# EasyEDA schematic DelayPCB.json
TITLE: Sheet_1; REV: 1.0; Date: 2022-11-04; Sheet: 1/1; Drawn By: dezire; Company: Your Company
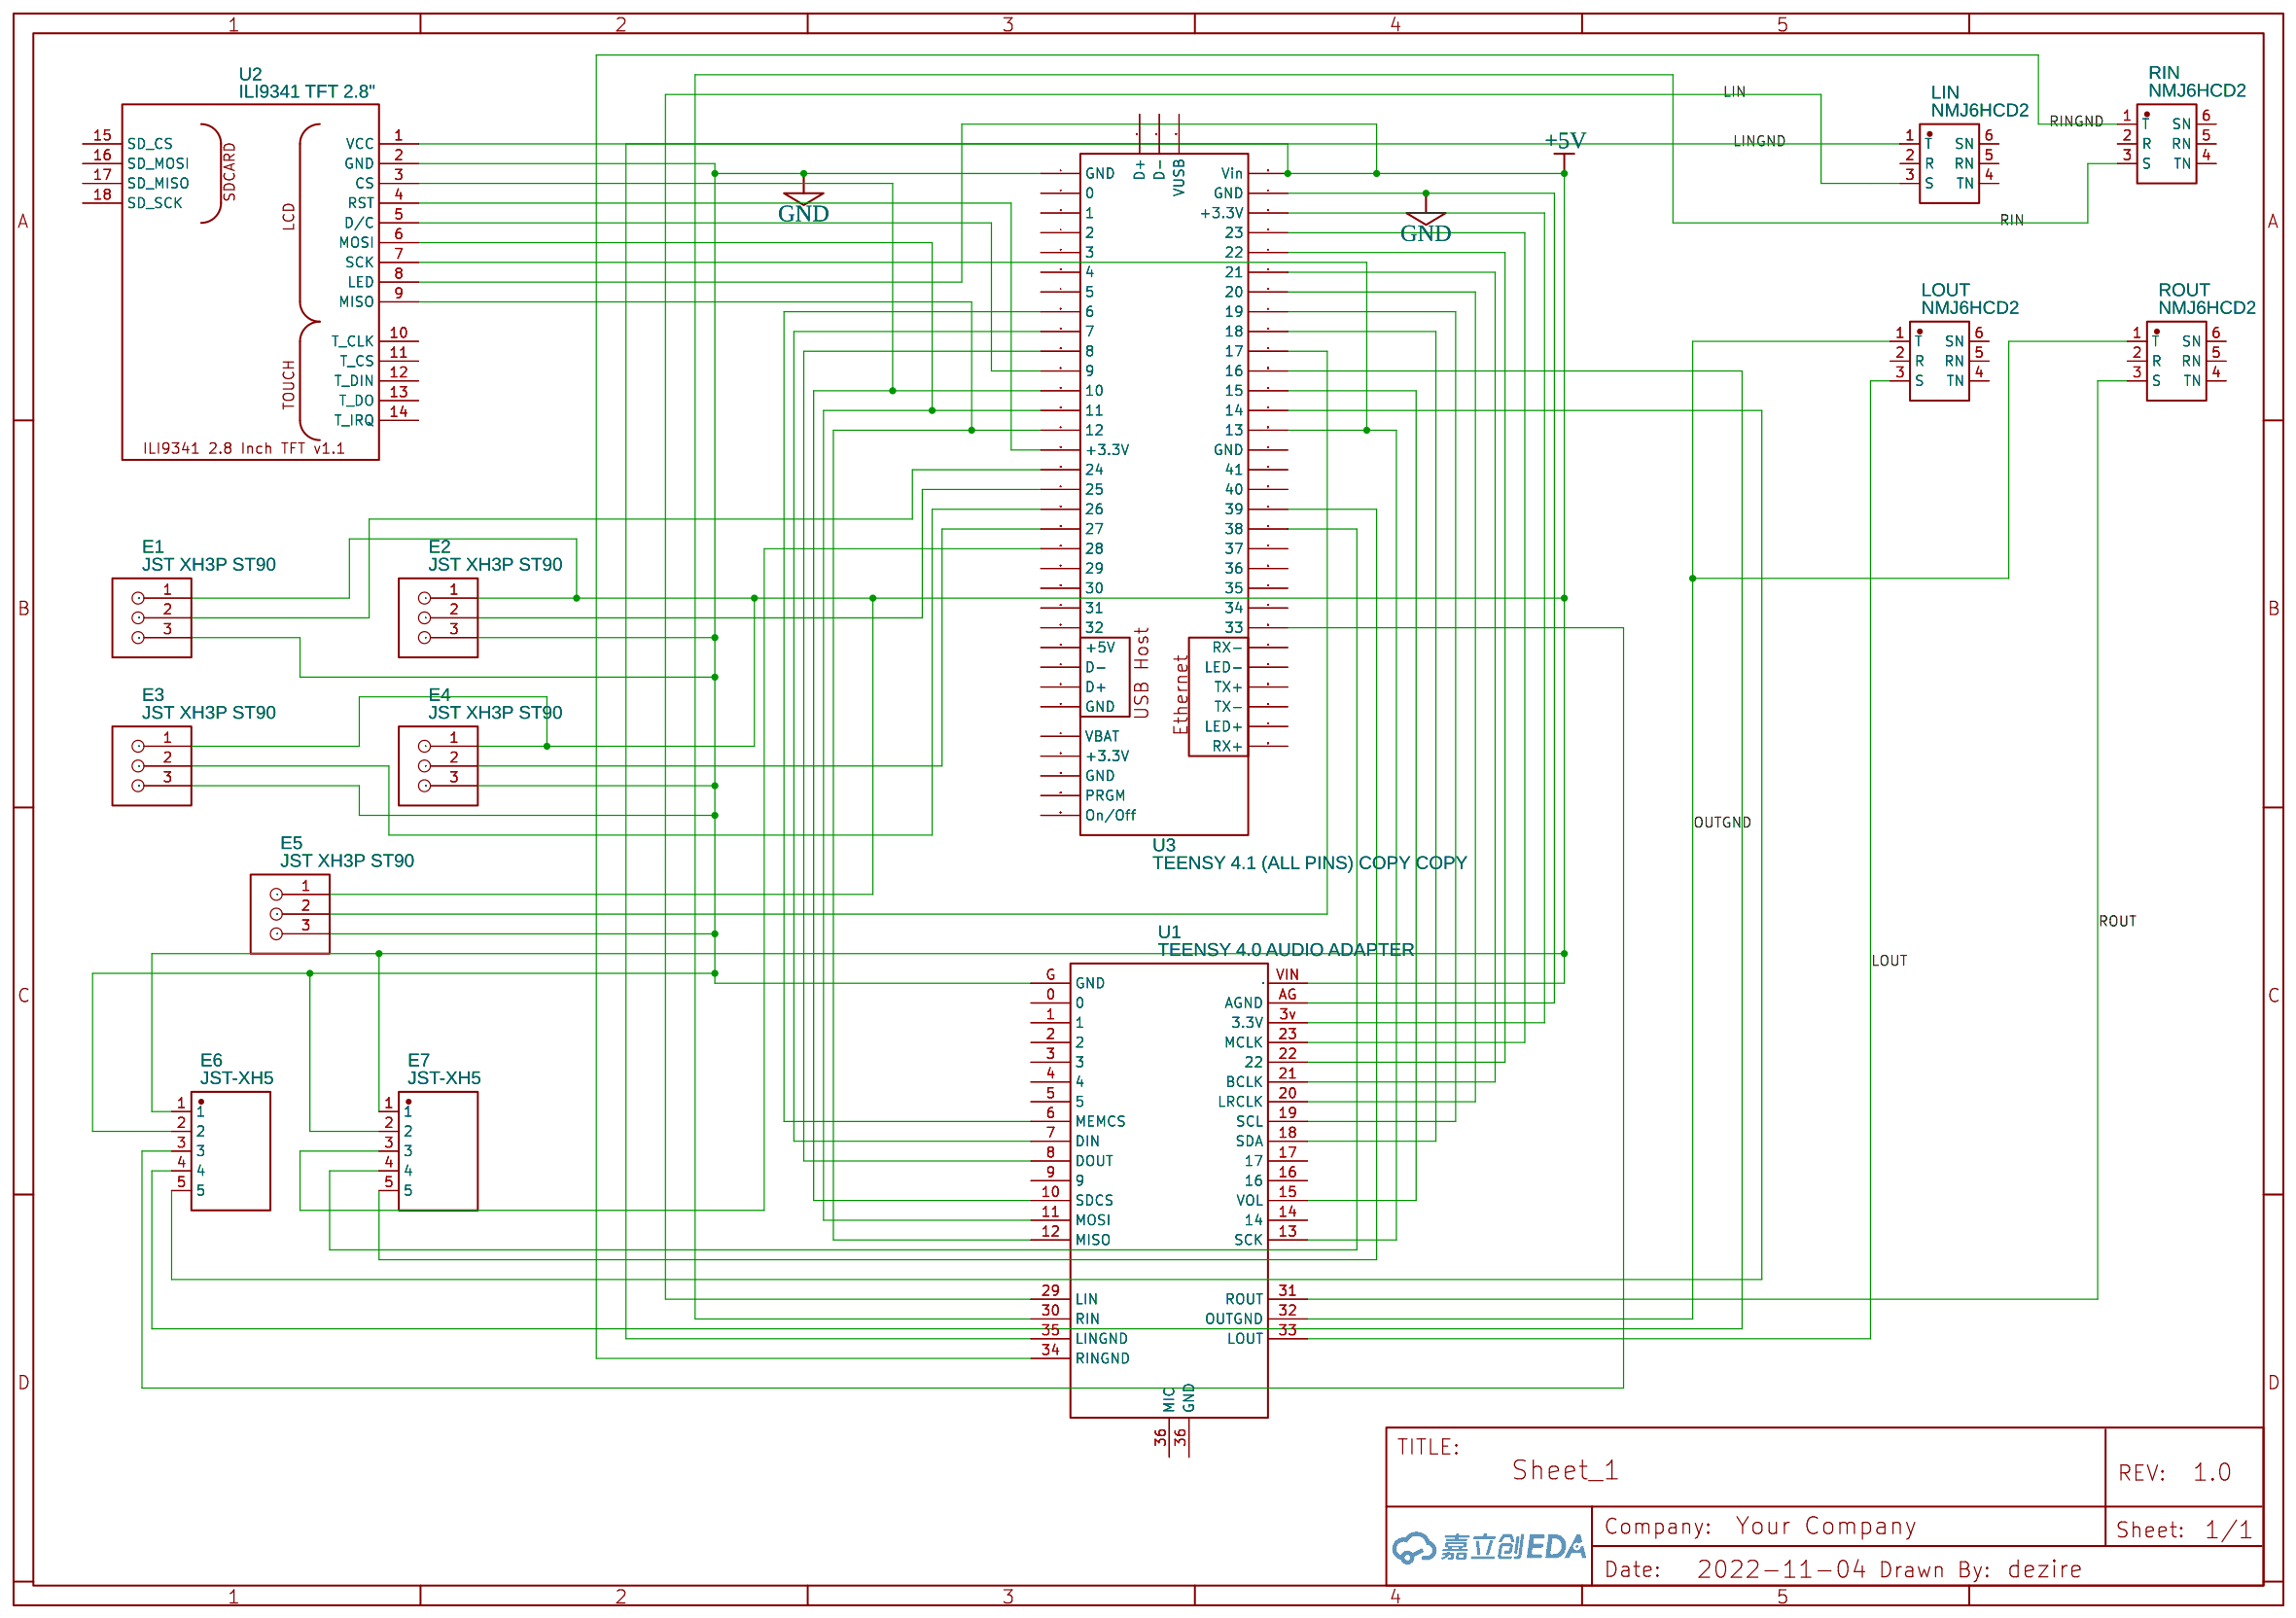
[diagram p0: schematic sheet]

## Parts
E1  JST XH3P ST90  [JST XH3P ST90]
E2  JST XH3P ST90  [JST XH3P ST90]
E3  JST XH3P ST90  [JST XH3P ST90]
E4  JST XH3P ST90  [JST XH3P ST90]
E5  JST XH3P ST90  [JST XH3P ST90]
E6  JST-XH5  [JST-XH5P]
E7  JST-XH5  [JST-XH5P]
LIN  NMJ6HCD2  [AUDIO-TH_NMJ6HCD2]
LOUT  NMJ6HCD2  [AUDIO-TH_NMJ6HCD2]
RIN  NMJ6HCD2  [AUDIO-TH_NMJ6HCD2]
ROUT  NMJ6HCD2  [AUDIO-TH_NMJ6HCD2]
U1  TEENSY 4.0 AUDIO ADAPTER  [TEENSY 4.0 AUDIO]
U2  ILI9341 TFT 2.8"  [ILI9341-2.8]
U3  TEENSY 4.1 (ALL PINS) COPY COPY  [TEENSY-4.1-ALL-PINS]

## Library data of the parts
E1-E5 = JST XH3P ST90: Manufacturer: JST; Supplier: Reichelt; Contributor: Benni620
E6 E7 = JST-XH5: Supplier: Reichelt; Supplier Part: JST XH5P ST; Manufacturer: JST; Contributor: P-Thomsen; JLCPCB Part Class: Extended Part; link: https://www.reichelt.de/jst-stiftleiste-gerade-1x5-polig-xh-jst-xh5p-st-p185076.html?&trstct=pos_2&nbc=1
LIN LOUT RIN ROUT = NMJ6HCD2: Supplier: LCSC; Supplier Part: C368502; Manufacturer: NEUTRIK(优曲克); Contributor: LCSC
U1 = TEENSY 4.0 AUDIO ADAPTER: Manufacturer Part: New SchematicLib; Contributor: Hugo Swift
U2 = ILI9341 TFT 2.8"
U3 = TEENSY 4.1 (ALL PINS) COPY COPY: Contributor: purpleprawn

## Nets
+5V: E1.1 E2.1 E3.1 E4.1 E5.1 E6.1 E7.1 U1.VIN(28) U2.1(VCC) U2.8(LED) U3.48(+3.3V)
GND: E1.3 E2.3 E3.3 E4.3 E5.3 E6.2 E7.2 U1.AG(AGND) U1.G(GND) U2.2(GND) U3.1(GND) U3.47(VBAT)
LIN: LIN.3(S) U1.29(LIN)
LINGND: LIN.1(T) U1.35(LINGND)
LOUT: LOUT.3(S) U1.33(LOUT)
OUTGND: LOUT.1(T) ROUT.1(T) U1.32(OUTGND)
RIN: RIN.3(S) U1.30(RIN)
RINGND: RIN.1(T) U1.34(RINGND)
ROUT: ROUT.3(S) U1.31(ROUT)
Net-(E1-2): E1.2 U3.16(24)
Net-(E2-2): E2.2 U3.17(25)
Net-(E3-2): E3.2 U3.18(26)
Net-(E4-2): E4.2 U3.19(27)
Net-(E5-2): E5.2 U3.39(17)
Net-(E6-3): E6.3 U3.25(33)
Net-(E6-4): E6.4 U3.38(16)
Net-(E6-5): E6.5 U3.36(14)
Net-(E7-3): E7.3 U3.20(28)
Net-(E7-4): E7.4 U3.30(38)
Net-(E7-5): E7.5 U3.31(39)
Net-(U1-3v): U1.3v(3.3V) U3.46(+3.3V)
Net-(U1-6): U1.6(MEMCS) U3.8(6)
Net-(U1-7): U1.7(DIN) U3.9(7)
Net-(U1-8): U1.8(DOUT) U3.10(8)
Net-(U1-10): U1.10(SDCS) U2.3(CS) U3.12(10)
Net-(U1-11): U1.11(MOSI) U2.6(MOSI) U3.13(11)
Net-(U1-12): U1.12(MISO) U2.9(MISO) U3.14(12)
Net-(U1-13): U1.13(SCK) U2.7(SCK) U3.35(13)
Net-(U1-15): U1.15(VOL) U3.37(15)
Net-(U1-18): U1.18(SDA) U3.40(18)
Net-(U1-19): U1.19(SCL) U3.41(19)
Net-(U1-20): U1.20(LRCLK) U3.42(GND)
Net-(U1-21): U1.21(BCLK) U3.43(D+)
Net-(U1-22): U1.22 U3.44(D-)
Net-(U1-23): U1.23(MCLK) U3.45(+5V)
Net-(U2-4): U2.4(RST) U3.15(+3.3V)
Net-(U2-5): U2.5(D/C) U3.11(9)

Not connected (* = marked no-connect by the designer): LIN 2(R) 4(TN) 5(RN) 6(SN); LOUT 2(R) 4(TN) 5(RN) 6(SN); RIN 2(R) 4(TN) 5(RN) 6(SN); ROUT 2(R) 4(TN) 5(RN) 6(SN); U1 0 1 2 3 4 5 9 14 16 17 36(GND); U2 10(T_CLK) 11(T_CS) 12(T_DIN) 13(T_DO) 14(T_IRQ) 15(SD_CS) 16(SD_MOSI) 17(SD_MISO) 18(SD_SCK); U3 2(0) 3(1) 4(2) 5(3) 6(4) 7(5) 21(29) 22(30) 23(31) 24(32) 26(34) 27(35) 28(36) 29(37) 32(40) 33(41) 34(GND) 49(GND) 50(PRGM) 51(On/Off) 52(VUSB) 60(RX+) 61(LED+) 62(TX-) 63(TX+) 64(LED-) 65(RX-) 66(D+) 67(D-)
